# Altium schematic sheet NNLightSwitcher_QSPI_Flash.SchDoc
size A4
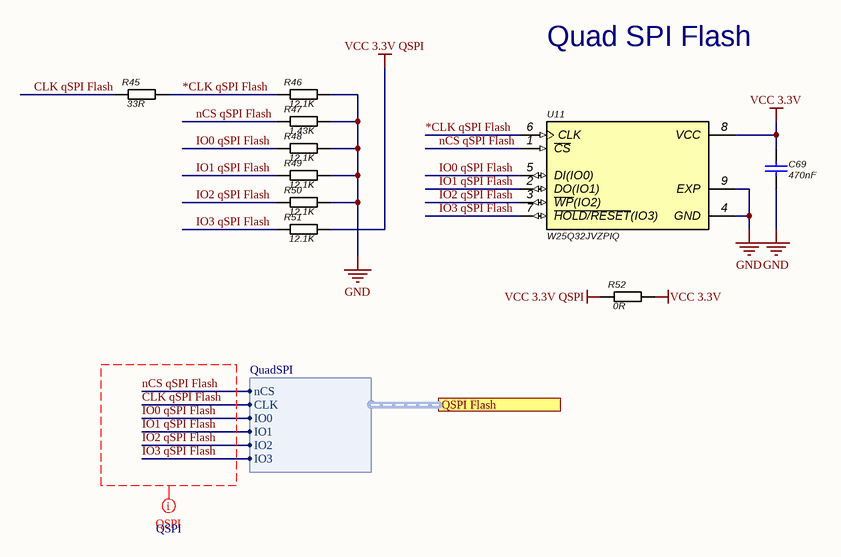
[diagram p0: NNLightSwitcher_QSPI_Flash.SchDoc]

## Parts
C69  470nF  [0402]
R45  33R  [0402]
R46  12.1K  [0402]
R47  1.43K  [0402]
R48  12.1K  [0402]
R49  12.1K  [0402]
R50  12.1K  [0402]
R51  12.1K  [0402]
R52  0R  [0402]
U11  W25Q32JVZPIQ  [*SON127P600X500X80-9N]

## Ports
QSPI Flash (harness QuadSPI)

## Harnesses
QuadSPI: IO1, IO0, IO3, IO2, CLK, nCS

## Nets
GND: C69.2 R46.2 R47.2 R48.2 R49.2 R50.2 U11.4(GND) U11.9(EXP)
VCC 3.3V: C69.1 R52.2 U11.8(VCC)
VCC 3.3V QSPI: R51.2 R52.1
*CLK qSPI Flash: R45.2 R46.1 U11.6(CLK)
CLK qSPI Flash: R45.1 ; port QSPI Flash.CLK
IO0 qSPI Flash: R48.1 U11.5(DI(IO0)) ; port QSPI Flash.IO0
IO1 qSPI Flash: R49.1 U11.2(DO(IO1)) ; port QSPI Flash.IO1
IO2 qSPI Flash: R50.1 U11.3(~{WP}(IO2)) ; port QSPI Flash.IO2
IO3 qSPI Flash: R51.1 U11.7(~{HOLD/RESET}(IO3)) ; port QSPI Flash.IO3
nCS qSPI Flash: R47.1 U11.1(~{CS}) ; port QSPI Flash.nCS

## Layout directives
net class QSPI: CLK qSPI Flash, IO0 qSPI Flash, IO1 qSPI Flash, IO2 qSPI Flash, IO3 qSPI Flash, nCS qSPI Flash

## Notes on the sheet
- Quad SPI Flash

## Library data of the parts
C69 = Capacitor 470nF: ComponentLink1Description: Datasheet link; ComponentLink1URL: http://www.yageo.com/documents/recent/UPY-GP_NP0_16V-to-50V_16.pdf
R45 = Resistor 33R
R46 R48-R51 = Resistor 12.1K
R47 = Resistor 1.43K
R52 = Resistor 0R
U11 = W25Q32JVZPIQ: Serial Flash Memory With Dual, Quad Spi; Manufacturer 1: Winbond; Value: *; ComponentLink1Description: http://www.winbond.com/resource-files/w25q32jv%20revg%2003272018%20plus.pdf?src-supplier=Digi-Key; ComponentLink1URL: http://www.winbond.com/resource-files/w25q32jv%20revg%2003272018%20plus.pdf?src-supplier=Digi-Key; Manufacturer Part Number 1: W25Q32JVZPIQ; Pricing 1: 1=0,79000, 10=0,71800, 25=0,70880, 50=0,70500, 100=0,63030, 300=0,62487, 500=0,61576, 1000=0,59355, 5000=0,54075 (USD); RoHS: No; Stock 1: 58629; Supplier 1: Digi-Key; Supplier Part Number 1: W25Q32JVZPIQ-ND